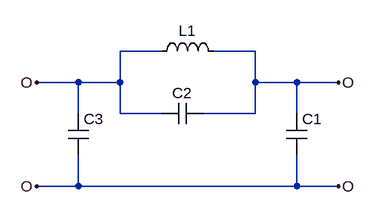
[diagram p0: schematic Ej2.asc]
Ej2.asc, the LTspice schematic file:
Version 4
SHEET 1 880 680
WIRE 192 0 128 0
WIRE 336 0 272 0
WIRE 64 48 0 48
WIRE 128 48 128 0
WIRE 128 48 64 48
WIRE 336 48 336 0
WIRE 400 48 336 48
WIRE 464 48 400 48
WIRE 64 96 64 48
WIRE 128 96 128 48
WIRE 192 96 128 96
WIRE 336 96 336 48
WIRE 336 96 256 96
WIRE 400 96 400 48
WIRE 64 208 64 160
WIRE 64 208 0 208
WIRE 400 208 400 160
WIRE 400 208 64 208
WIRE 464 208 400 208
FLAG 0 48 O
FLAG 0 208 O
FLAG 464 48 O
FLAG 464 208 O
SYMBOL cap 384 96 R0
SYMATTR InstName C1
SYMATTR Value ""
SYMBOL cap 256 80 R90
WINDOW 0 0 32 VBottom 2
WINDOW 3 32 32 VTop 2
SYMATTR InstName C2
SYMATTR Value ""
SYMBOL ind 176 16 R270
WINDOW 0 32 56 VTop 2
WINDOW 3 5 56 VBottom 2
SYMATTR InstName L1
SYMATTR Value ""
SYMBOL cap 48 96 R0
SYMATTR InstName C3
SYMATTR Value ""

The netlist it stands for:
* Ej2.asc
C1 O O
C2 O O
L1 O O
C3 O O
.backanno
.end